# Altium schematic sheet CHIBI SMPS_20181126.SchDoc: Title (part 1 of 2)
size A2; PageSetup: Record=PageOptions|CenterHorizontal=True|CenterVertical=True|PrintScale=0.71|XCorrection=1.00|YCorrection=1.00|PrintKind=0|BorderSize=5000000|LeftOffset=0|BottomOffset=0|Orientation=2|PaperLength=4200|PaperWidth=2970|Scale=100|PaperSource=7|PrintQuality=600|MediaType=1|DitherType=10|PrintScaleMode=1|PaperKind=A3|PaperIndex=8; ApprovedBy: Enter Name; CheckedBy: Enter Name; DrawnBy: Enter Name; Organization: Tymphany; Address1: 2/F, BBK Building; Address2: No. 89 Ande Street, Shang Meilin; Address3: Futian District, Shenzhen; Address4: GuangDong, P.R.C. 518049, China; DocumentNumber: 6; Revision: 0.0.0; SheetNumber: 6; SheetTotal: 6; ProductName: Product Name; PartNumber: Part Number; ModifiedBy: Enter Name; LeadEngineer: Enter Name; Stage: Concept; DCR: 238m|?|OWNERINDEX=8310; DCR: 238m|?|OWNERINDEX=8345; ProjectName: Project Name
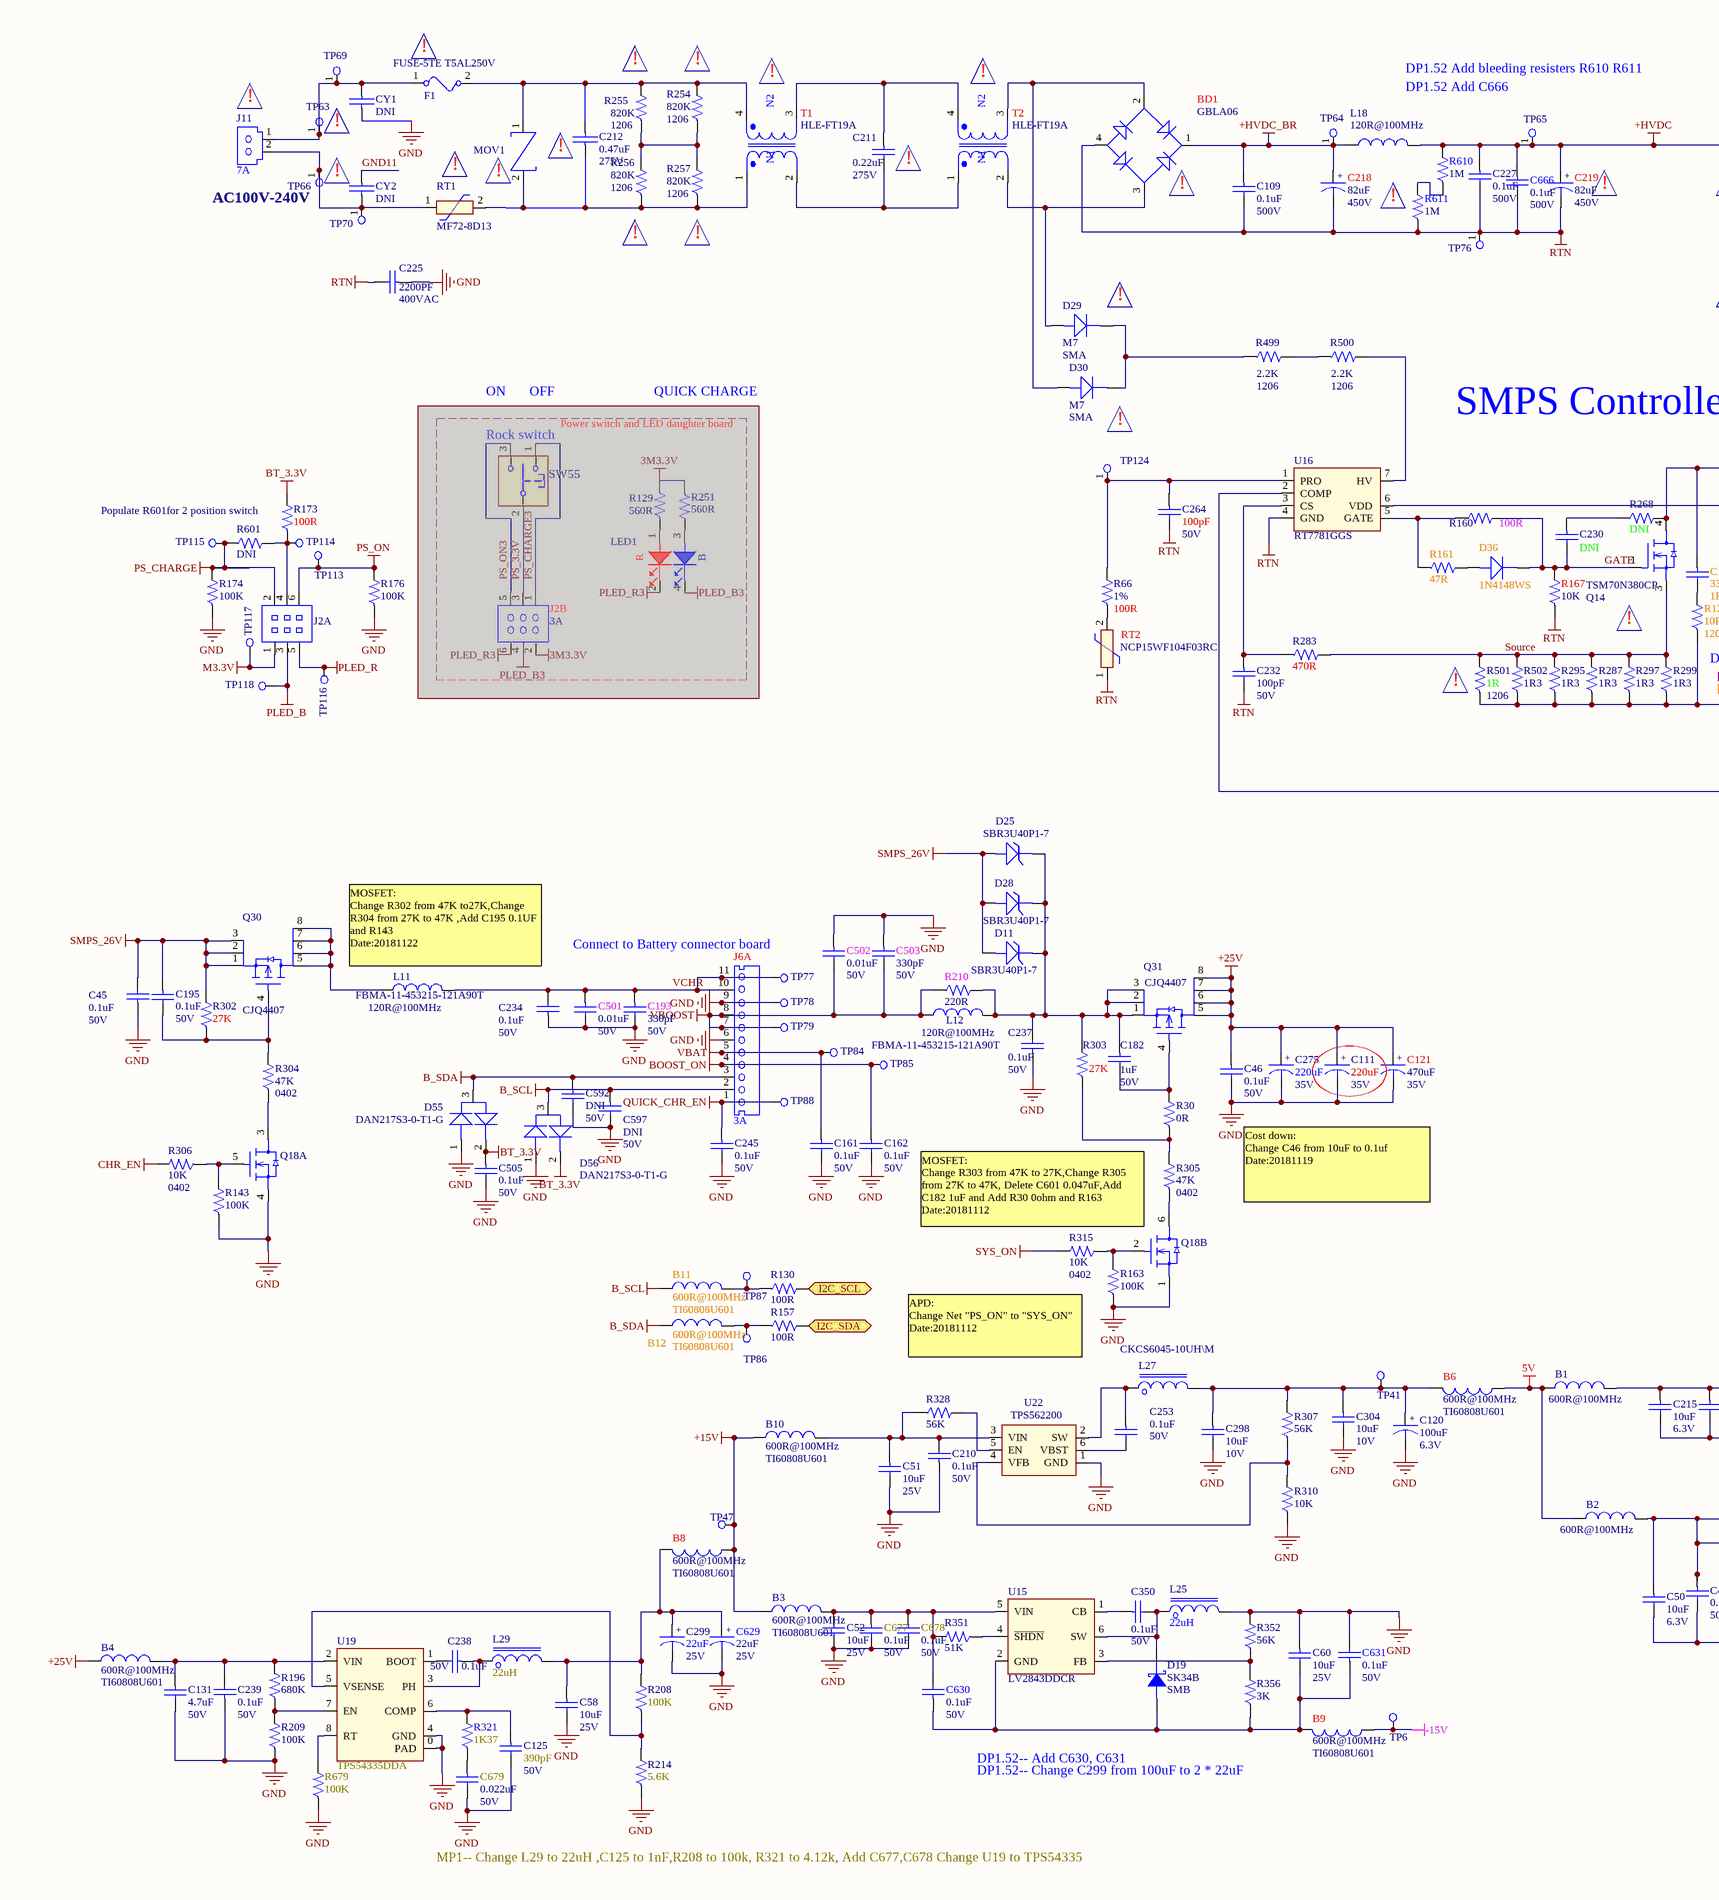
[diagram p0: CHIBI SMPS_20181126.SchDoc, left]
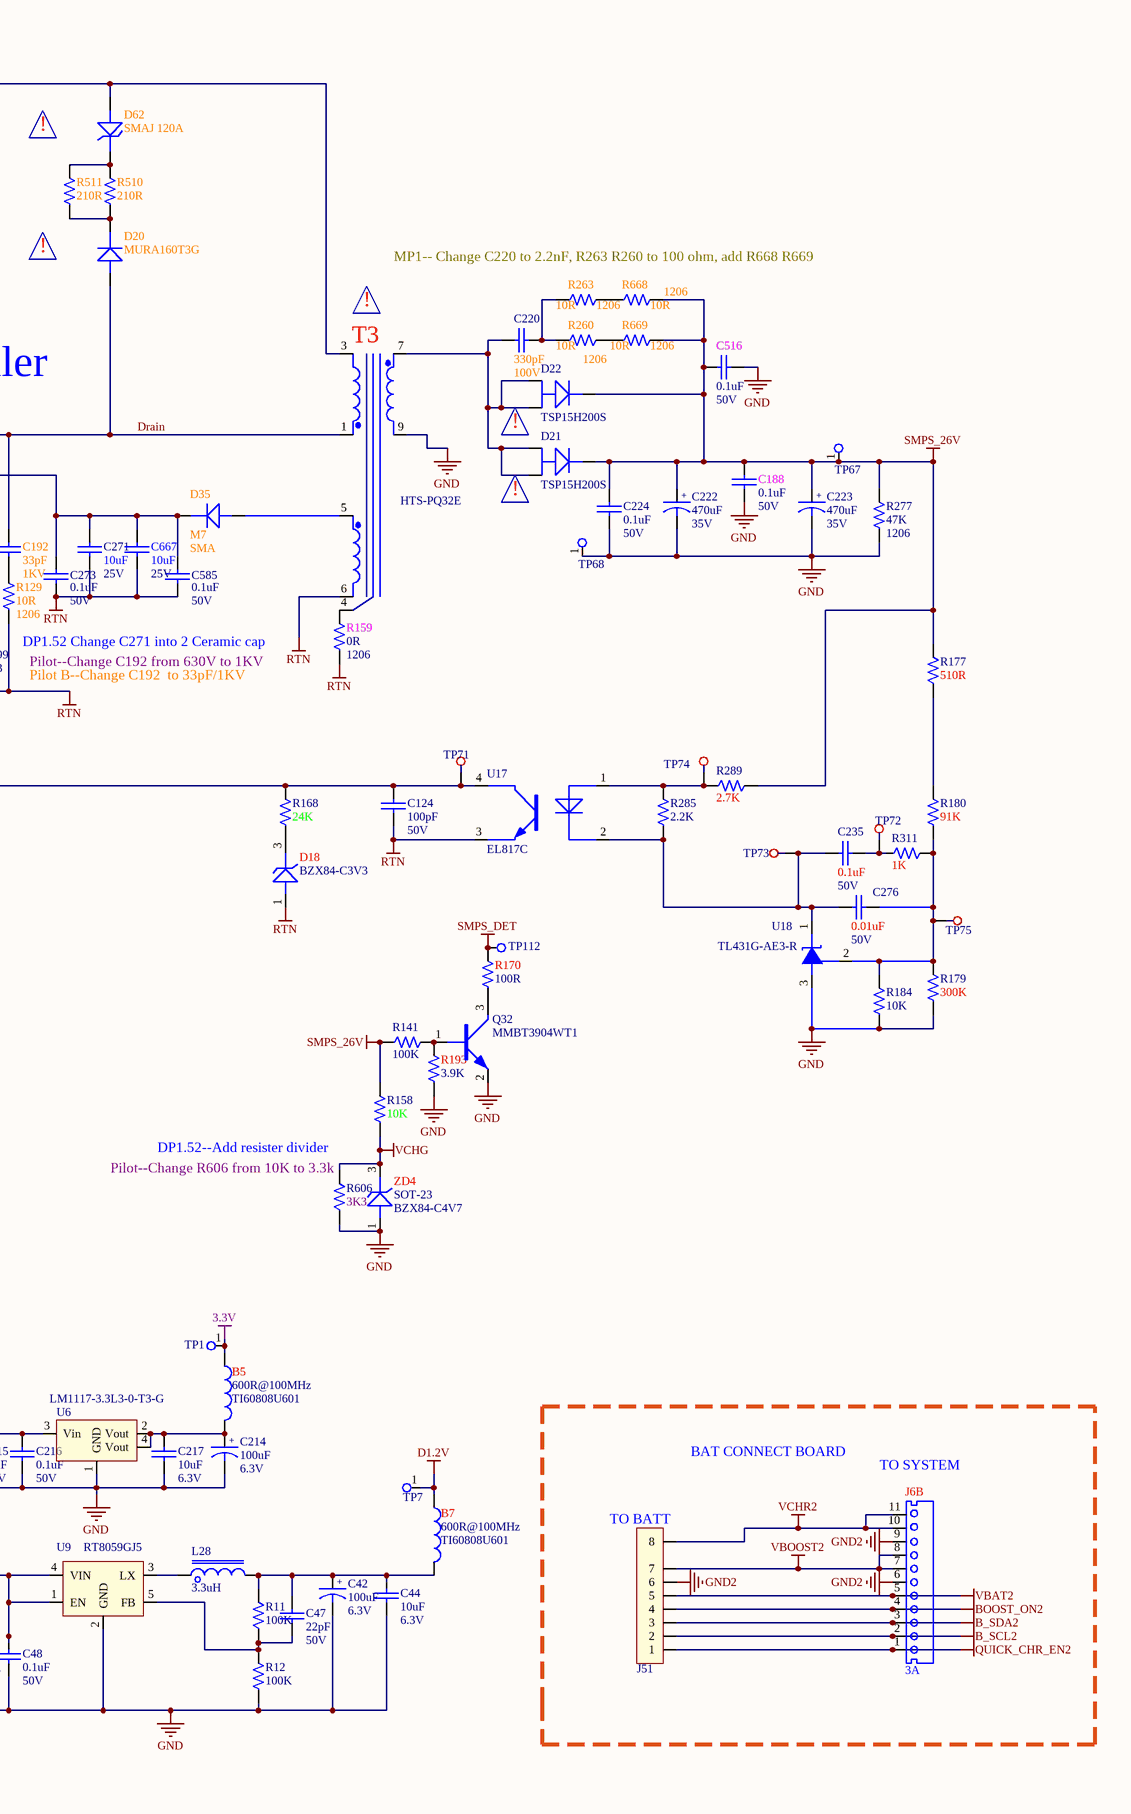
[diagram p1: CHIBI SMPS_20181126.SchDoc, right]

## Parts
(Parts that share a designator on the sheet are numbered #1, #2 ... from top to bottom, then left to right.)
B1  value 600R@100MHz  [L0603-RW]  (hidden comment: SCBA06031-6010)
B2  value 600R@100MHz  [L0603-RW]  (hidden comment: SCBA06031-6010)
B3  value 600R@100MHz  MFG Part: TI60808U601  [L0603-RW]  (hidden comment: SCBA06031-6010)
B4  value 600R@100MHz  MFG Part: TI60808U601  [L0603-RW]  (hidden comment: SCBA06031-6010)
B5  value 600R@100MHz  MFG Part: TI60808U601  [L0603-RW]  (hidden comment: SCBA06031-6010)
B6  value 600R@100MHz  MFG Part: TI60808U601  [L0603-RW]  (hidden comment: SCBA06031-6010)
B7  value 600R@100MHz  MFG Part: TI60808U601  [L0603-RW]  (hidden comment: SCBA06031-6010)
B8  value 600R@100MHz  MFG Part: TI60808U601  [L0603-RW]  (hidden comment: SCBA06031-6010)
B9  value 600R@100MHz  MFG Part: TI60808U601  [L0603-RW]  (hidden comment: SCBA06031-6010)
B10  value 600R@100MHz  MFG Part: TI60808U601  [L0603-RW]  (hidden comment: SCBA06031-6010)
B11  value 600R@100MHz  MFG Part: TI60808U601  [L0603-RW]  (hidden comment: SCBA06031-6010)
B12  value 600R@100MHz  MFG Part: TI60808U601  [L0603-RW]  (hidden comment: SCBA06031-6010)
BD1  T571002850104  [GBL]  (value not drawn)
C42  value 100uF  Voltage: 6.3V  [CASE - C]  (hidden comment: PBE099520-1010)
C44  value 10uF  Voltage: 6.3V  [CAPC0603-RW]  (hidden comment: PXL426521-1060)
C45  value 0.1uF  Voltage: 50V  [CAPC0402-RW]  (hidden comment: PWL456470-1040)
C46  value 0.1uF  Voltage: 50V  [CAPC0402-RW]  (hidden comment: T545011047505)
C47  value 22pF  Voltage: 50V  [CAPC0402-RW]  (hidden comment: PWL410370-2200)
C48  value 0.1uF  Voltage: 50V  [CAPC0402-RW]  (hidden comment: PWL456470-1040)
C50  value 10uF  Voltage: 6.3V  [CAPC0603-RW]  (hidden comment: PXL426521-1060)
C51  value 10uF  Voltage: 25V  [CAPC0805-RW]  (hidden comment: PYL426450-1060)
C52  value 10uF  Voltage: 25V  [CAPC0805-RW]  (hidden comment: PYL426450-1060)
C58  value 10uF  Voltage: 25V  [CAPC0805-RW]  (hidden comment: PYL426450-1060)
C60  value 10uF  Voltage: 25V  [CAPC0805-RW]  (hidden comment: PYL426450-1060)
C109  value 0.1uF  Voltage: 500V  [CAPC3225(1210)-RW]  (hidden comment: T542051047906)
C111  value 220uF  Voltage: 35V  [CASE - F]  (hidden comment: PBE099560-2210)
C120  value 100uF  Voltage: 6.3V  [CASE - C]  (hidden comment: PBE099520-1010)
C121  value 470uF  Voltage: 35V  [CASE - G12.5]  (hidden comment: T551471455000)
C124  value 100pF  Voltage: 50V  [CAPC0603-RW]  (hidden comment: PXL410370-1010)
C125  value 390pF  Voltage: 50V  [CAPC0603-RW]  (hidden comment: T541023916508)
C131  value 4.7uF  Voltage: 50V  [CAPC0805-RW]  (hidden comment: PYL456470-4750)
C161  value 0.1uF  Voltage: 50V  [CAPC0402-RW]  (hidden comment: PWL456470-1040)
C162  value 0.1uF  Voltage: 50V  [CAPC0402-RW]  (hidden comment: PWL456470-1040)
C182  value 1uF  Voltage: 50V  [CAPC0603-RW]  (hidden comment: T542021057508)
C188  value 0.1uF  Voltage: 50V  [CAPC0603-RW]  (hidden comment: PXL456470-1040)
C192  value 33pF  Voltage: 1KV  [CAPC1206-RW]  (hidden comment: T541043306H08)
C193  value 330pF  Voltage: 50V  [CAPC0402-RW]  (hidden comment: PWL410371-3310)
C195  value 0.1uF  Voltage: 50V  [CAPC0603-RW]  (hidden comment: PXL456470-1040)
C210  value 0.1uF  Voltage: 50V  [CAPC0603-RW]  (hidden comment: PXL456470-1040)
C211  value 0.22uF  Voltage: 275V  [CAP_T6W18H12 PH15]  (hidden comment: CAP 0.22uF 275V 10% -T6W18H12 PH15)
C212  value 0.47uF  Voltage: 275V  [CAP_NP_RADIAL_T8.4W18H14P15]  (hidden comment: PVX2394G0-4740)
C214  value 100uF  Voltage: 6.3V  [CASE - C]  (hidden comment: PBE099520-1010)
C215  value 10uF  Voltage: 6.3V  [CAPC0603-RW]  (hidden comment: PXL426521-1060)
C216  value 0.1uF  Voltage: 50V  [CAPC0402-RW]  (hidden comment: PWL456470-1040)
C217  value 10uF  Voltage: 6.3V  [CAPC0603-RW]  (hidden comment: PXL426521-1060)
C218  value 82uF  Voltage: 450V  [CAP_Radial_D18L25P7.5]  (hidden comment: T5528204D3010)
C219  value 82uF  Voltage: 450V  [CAP_Radial_D18L25P7.5]  (hidden comment: T5528204D3010)
C220  value 330pF  Voltage: 100V  [CAPC0603-RW]  (hidden comment: PXL4564A0-3310)
C222  value 470uF  Voltage: 35V  [CASE - G12.5]  (hidden comment: T551471455000)
C223  value 470uF  Voltage: 35V  [CASE - G12.5]  (hidden comment: T551471455000)
C224  value 0.1uF  Voltage: 50V  [CAPC0603-RW]  (hidden comment: PXL456470-1040)
C225  value 2200PF  Voltage: 400VAC  [Y1 102M40AXC3  Y1 222M40AXC3]  (hidden comment: T564222414030)
C227  value 0.1uF  Voltage: 500V  [CAPC3225(1210)-RW]  (hidden comment: T542051047906)
C230  SAP: DNI  [CAPC1206-RW]  (hidden comment: PZL4103M1-1010)
C232  value 100pF  Voltage: 50V  [CAPC0603-RW]  (hidden comment: PXL410370-1010)
C234  value 0.1uF  Voltage: 50V  [CAPC0402-RW]  (hidden comment: PWL456470-1040)
C235  value 0.1uF  Voltage: 50V  [CAPC0603-RW]  (hidden comment: PXL456470-1040)
C237  value 0.1uF  Voltage: 50V  [CAPC0402-RW]  (hidden comment: PWL456470-1040)
C238  value 0.1uF  Voltage: 50V  [CAPC0603-RW]  (hidden comment: PXL456470-1040)
C239  value 0.1uF  Voltage: 50V  [CAPC0603-RW]  (hidden comment: PXL456470-1040)
C245  value 0.1uF  Voltage: 50V  [CAPC0402-RW]  (hidden comment: PWL456470-1040)
C253  value 0.1uF  Voltage: 50V  [CAPC0603-RW]  (hidden comment: PXL456470-1040)
C264  value 100pF  Voltage: 50V  [CAPC0603-RW]  (hidden comment: PXL410370-1010)
C271  value 10uF  Voltage: 25V  [CAPC1206-RW]  (hidden comment: PZL456450-1060)
C273  value 0.1uF  Voltage: 50V  [CAPC0402-RW]  (hidden comment: PWL456470-1040)
C275  value 220uF  Voltage: 35V  [CASE - F]  (hidden comment: PBE099560-2210)
C276  value 0.01uF  Voltage: 50V  [CAPC0603-RW]  (hidden comment: T542021036508)
C298  value 10uF  Voltage: 10V  [CAPC0603-RW]  (hidden comment: T54000000260E)
C299  value 22uF  Voltage: 25V  [CASE - C]  (hidden comment: PBE099550-2200)
C304  value 10uF  Voltage: 10V  [CAPC0603-RW]  (hidden comment: T54000000260E)
C350  value 0.1uF  Voltage: 50V  [CAPC0603-RW]  (hidden comment: PXL456470-1040)
C501  value 0.01uF  Voltage: 50V  [CAPC0402-RW]  (hidden comment: PWL456470-1030)
C502  value 0.01uF  Voltage: 50V  [CAPC0402-RW]  (hidden comment: PWL456470-1030)
C503  value 330pF  Voltage: 50V  [CAPC0402-RW]  (hidden comment: PWL410371-3310)
C505  value 0.1uF  Voltage: 50V  [CAPC0402-RW]  (hidden comment: PWL456470-1040)
C516  value 0.1uF  Voltage: 50V  [CAPC0603-RW]  (hidden comment: PXL456470-1040)
C585  value 0.1uF  Voltage: 50V  [CAPC0402-RW]  (hidden comment: PWL456470-1040)
C592  value DNI  Voltage: 50V  [CAPC0402-RW]  (hidden comment: T54000000484E)
C597  value DNI  Voltage: 50V  [CAPC0402-RW]  (hidden comment: T54000000484E)
C629  value 22uF  Voltage: 25V  [CASE - C]  (hidden comment: PBE099550-2200)
C630  value 0.1uF  Voltage: 50V  [CAPC0603-RW]  (hidden comment: PXL456470-1040)
C631  value 0.1uF  Voltage: 50V  [CAPC0603-RW]  (hidden comment: PXL456470-1040)
C666  value 0.1uF  Voltage: 500V  [CAPC3225(1210)-RW]  (hidden comment: T542051047906)
C667  value 10uF  Voltage: 25V  [CAPC1206-RW]  (hidden comment: PZL456450-1060)
C677  value 0.1uF  Voltage: 50V  [CAPC0402-RW]  (hidden comment: PWL456470-1040)
C678  value 0.1uF  Voltage: 50V  [CAPC0402-RW]  (hidden comment: PWL456470-1040)
C679  value 0.022uF  Voltage: 50V  [CAPC0603-RW]  (hidden comment: PXL456470-2230)
CY1  value DNI  [CAP_NP_RADIAL_T6.5L17H12P10]  (hidden comment: PLY1365K0-1040)
CY2  value DNI  [CAP_NP_RADIAL_T6.5L17H12P10]  (hidden comment: PLY1365K0-1040)
D11  T571002830230  [PowerDI-123]  (value not drawn)
D18  T573000910415  [SOT23-132-RW]  (value not drawn)
D19  MFG Part: SK34B  Package: SMB  [SMB-Pad2.3X2.5]  (hidden comment: T572006222208)
D20  T571002720225  [SMA]  (value not drawn)
D21  T572005721008  [TO-277A (SMPC)]  (value not drawn)
D22  T572005721008  [TO-277A (SMPC)]  (value not drawn)
D25  T571002830230  [PowerDI-123]  (value not drawn)
D28  T571002830230  [PowerDI-123]  (value not drawn)
D29  MFG Part: M7  [SMA]  (hidden comment: T571002880658)
D30  MFG Part: M7  [SMA]  (hidden comment: T571002880658)
D35  MFG Part: M7  [SMA]  (hidden comment: T571002880658)
D36  RCD114148-0020  [SOD-323]  (value not drawn)
D55  T572006171251  [SOT323(SC-70)-R]  (value not drawn)
D56  T572006171251  [SOT323(SC-70)-R]  (value not drawn)
D62  T572006272108  [SMA]  (value not drawn)
F1  MFG Part: FUSE-5TE T5AL250V  [FUSE-TE5-8540]  (hidden comment: T690100003600)
J2A  T690300110100  [HOUSING  6P 2X3 PH=2.54mm 180  H8.5mm_2.54Y-2X3P-11.5]  (value not drawn)
J2B  Current: 3A  [HEAD 6P 2X3 PH=2.54mm 180 H8.5mm]  (hidden comment: T690300101200)  (masked out: inside a compile mask, not in the netlist)
J6A  Current: 3A  [CONN 11P PH=2.5 ST TJC3-11A-CS]  (hidden comment: T690300109800)
J6B  Current: 3A  [CONN 11P PH=2.5 ST TJC3-11A-CS]  (hidden comment: T690300109800)
J11  Current: 7A  [CONN 2P PH=3.96mm RM Mid-PIN_JINJIA_VH-3A2-01]  (hidden comment: T690300109500)
J51  T690300109900  [HEAD 8P PH=2.5mm SR ST TSB1-05281-3BT8A]  (value not drawn)
L11  value 120R@100MHz  MFG Part: FBMA-11-453215-121A90T  [L1812(4532)]  (hidden comment: T710500015400)
L12  value 120R@100MHz  MFG Part: FBMA-11-453215-121A90T  [L1812(4532)]  (hidden comment: T710500015400)
L18  value 120R@100MHz  [L1812(4532)]  (hidden comment: T710500015400)
L25  value 22uH  [GPSR0550-220M]  (hidden comment: T621000054100)
L27  MFG Part: CKCS6045-10UH\M  [IND MPIT6045]  (hidden comment: T621000050100)
L28  value 3.3uH  [IND MPIT252012]  (hidden comment: T621000050300)
L29  value 22uH  [GPSR0550-220M]  (hidden comment: T621000054100)
LED1  KCD260004-0010  [SMTLED2.0*1.25-RGB]  (value not drawn)  (masked out: inside a compile mask, not in the netlist)
MOV1  RHU014561-4001  [TVR14561RSY]  (value not drawn)
Q14  T586000010398  [TO252-3]  (value not drawn)
Q18  RCM027002-1001  [SOT-363]  (value not drawn)  (parts A,B of 2)
Q30  T585002521866  [SO8]  (value not drawn)
Q31  T585002521866  [SO8]  (value not drawn)
Q32  T581003992440  [SOT323(SC-70)-R]  (value not drawn)
R11  value 100K  [0402-RW]  (hidden comment: QCF161240-1003)
R12  value 100K  [0402-RW]  (hidden comment: QCF161240-1003)
R30  value 0R  [0402-RW]  (hidden comment: QCF165240-0000)
R66  value 100R  TOL: 1%  [0603-RW]  (hidden comment: T502100002399)
R129#1  value 560R  [0603-RW]  (hidden comment: QCF011030-5600)  (masked out: inside a compile mask, not in the netlist)
R129#2  value 10R  PACKAGE: 1206  [1206-RW]  (hidden comment: QCF045010-1000)
R130  value 100R  [0402-RW]  (hidden comment: QCF161240-1000)
R141  value 100K  [0402-RW]  (hidden comment: QCF161240-1003)
R143  value 100K  [0402-RW]  (hidden comment: QCF161240-1003)
R157  value 100R  [0402-RW]  (hidden comment: QCF161240-1000)
R158  value 10K  [0402-RW]  (hidden comment: QCF161240-1002)
R159  value 0R  PACKAGE: 1206  [1206-RW]  (hidden comment: QCF045010-0000)
R160  value 100R  [0603-RW]  (hidden comment: QCF011030-1000)
R161  value 47R  [0805-RW]  (hidden comment: QCF081020-4709)
R163  value 100K  [0402-RW]  (hidden comment: QCF161240-1003)
R167  value 10K  [0805-RW]  (hidden comment: QCF081020-1002)
R168  value 24K  [0603-RW]  (hidden comment: QCF011030-2402)
R170  value 100R  [0402-RW]  (hidden comment: QCF161240-1000)
R173  value 100R  [0402-RW]  (hidden comment: QCF161240-1000)
R174  value 100K  [0402-RW]  (hidden comment: QCF161240-1003)
R176  value 100K  [0402-RW]  (hidden comment: QCF161240-1003)
R177  value 510R  [0603-RW]  (hidden comment: QCF011030-5100)
R179  value 300K  [0603-RW]  (hidden comment: QCF011030-3003)
R180  value 91K  [0603-RW]  (hidden comment: QCF011030-9102)
R184  value 10K  [0603-RW]  (hidden comment: QCF011030-1002)
R193  value 3.9K  [0402-RW]  (hidden comment: QCF161241-3901)
R196  value 680K  [0402-RW]  (hidden comment: QCF161240-6803)
R208  value 100K  [0402-RW]  (hidden comment: QCF161240-1003)
R209  value 100K  [0402-RW]  (hidden comment: QCF161240-1003)
R210  value 220R  [0603-RW]  (hidden comment: QCF011030-2200)
R214  value 5.6K  [0402-RW]  (hidden comment: T502560101399)
R251  value 560R  [0603-RW]  (hidden comment: QCF011030-5600)  (masked out: inside a compile mask, not in the netlist)
R254  value 820K  PACKAGE: 1206  [1206-RW]  (hidden comment: QCF041010-8203)
R255  value 820K  PACKAGE: 1206  [1206-RW]  (hidden comment: QCF041010-8203)
R256  value 820K  PACKAGE: 1206  [1206-RW]  (hidden comment: QCF041010-8203)
R257  value 820K  PACKAGE: 1206  [1206-RW]  (hidden comment: QCF041010-8203)
R260  value 10R  PACKAGE: 1206  [1206-RW]  (hidden comment: QCF045010-1000)
R263  value 10R  PACKAGE: 1206  [1206-RW]  (hidden comment: QCF045010-1000)
R268  SAP: DNI  [1206-RW]  (hidden comment: QCF041010-4708)
R277  value 47K  PACKAGE: 1206  [1206-RW]  (hidden comment: QCF041010-4702)
R283  value 470R  [0603-RW]  (hidden comment: QCF011030-4700)
R285  value 2.2K  [0603-RW]  (hidden comment: QCF011030-2201)
R287  value 1R3  [1206-RW]  (hidden comment: T710600016700)
R289  value 2.7K  [0603-RW]  (hidden comment: QCF011030-2701)
R295  value 1R3  [1206-RW]  (hidden comment: T710600016700)
R297  value 1R3  [1206-RW]  (hidden comment: T710600016700)
R299  value 1R3  [1206-RW]  (hidden comment: T710600016700)
R302  value 27K  [0402-RW]  (hidden comment: QCF161242-2702)
R303  value 27K  [0402-RW]  (hidden comment: QCF161242-2702)
R304  value 47K  PACKAGE: 0402  [0402-RW]  (hidden comment: QCF161243-4702)
R305  value 47K  PACKAGE: 0402  [0402-RW]  (hidden comment: QCF161243-4702)
R306  value 10K  PACKAGE: 0402  [0402-RW]  (hidden comment: QCF161240-1002)
R307  value 56K  [0402-RW]  (hidden comment: QCF161240-5602)
R310  value 10K  [0402-RW]  (hidden comment: QCF161240-1002)
R311  value 1K  [0603-RW]  (hidden comment: QCF011030-1001)
R315  value 10K  PACKAGE: 0402  [0402-RW]  (hidden comment: QCF161240-1002)
R321  value 1K37  [0603-RW]  (hidden comment: T502137102399)
R328  value 56K  [0402-RW]  (hidden comment: QCF161240-5602)
R351  value 51K  [0603-RW]  (hidden comment: QCF011030-5102)
R352  value 56K  [0402-RW]  (hidden comment: QCF161240-5602)
R356  value 3K  [0603-RW]  (hidden comment: QCF011030-3001)
R499  value 2.2K  PACKAGE: 1206  [1206-RW]  (hidden comment: QCF041010-2201)
R500  value 2.2K  PACKAGE: 1206  [1206-RW]  (hidden comment: QCF041010-2201)
R501  value 1R  PACKAGE: 1206  [1206-RW]  (hidden comment: T710600016600)
R502  value 1R3  [1206-RW]  (hidden comment: T710600016700)
R510  value 210R  [1206-RW]  (hidden comment: T502210004399)
R511  value 210R  [1206-RW]  (hidden comment: T502210004399)
R601  value DNI  [0603-RW]  (hidden comment: QCF011030-1002)
R606  value 3K3  [0402-RW]  (hidden comment: QCF161241-3301)
R610  value 1M  [0805-RW]  (hidden comment: QCF081020-1004)
R611  value 1M  [0805-RW]  (hidden comment: QCF081020-1004)
R668  value 10R  PACKAGE: 1206  [1206-RW]  (hidden comment: QCF045010-1000)
R669  value 10R  PACKAGE: 1206  [1206-RW]  (hidden comment: QCF045010-1000)
R679  value 100K  [0402-RW]  (hidden comment: QCF161240-1003)
RT1  RNT004001-0001  [MF72-8D13]  (value not drawn)
RT2  MFG Part: NCP15WF104F03RC  [0402-RW]  (hidden comment: T710600016200)
SW55  T670000000300  [ROCKER SW RS601K-103]  (value not drawn)  (masked out: inside a compile mask, not in the netlist)
T1  MFG Part: HLE-FT19A  [COMMON IND HLE-FT19A]  (hidden comment: T621000052200)
T2  MFG Part: HLE-FT19A  [COMMON IND HLE-FT19A]  (hidden comment: T621000052200)
T3  T622000009700  [HTS-PQ32E]  (value not drawn)
TP1  D3.3V  [TP_1.5mm]  (value not drawn)
TP6  TP  [TP_1.2mm]  (value not drawn)
TP7  D1.2V  [TP_1.2mm]  (value not drawn)
TP41  TP  [TP_1.2mm]  (value not drawn)
TP47  TP  [TP_1.2mm]  (value not drawn)
TP63  TP  [TP_2.0mm]  (value not drawn)
TP64  TP  [TP_2.0mm]  (value not drawn)
TP65  TP  [TP_2.0mm]  (value not drawn)
TP66  TP  [TP_2.0mm]  (value not drawn)
TP67  TP  [TP_1.8mm]  (value not drawn)
TP68  TP  [TP_1.8mm]  (value not drawn)
TP69  TP  [TP_2.0mm]  (value not drawn)
TP70  TP  [TP_2.0mm]  (value not drawn)
TP71  1.0mm  [TP_1.0mm]  (value not drawn)
TP72  1.0mm  [TP_1.0mm]  (value not drawn)
TP73  1.0mm  [TP_1.0mm]  (value not drawn)
TP74  1.0mm  [TP_1.0mm]  (value not drawn)
TP75  1.0mm  [TP_1.0mm]  (value not drawn)
TP76  TP  [TP_2.0mm]  (value not drawn)
TP77  TP  [TP_1.2mm]  (value not drawn)
TP78  TP  [TP_1.2mm]  (value not drawn)
TP79  TP  [TP_1.2mm]  (value not drawn)
TP84  TP  [TP_1.2mm]  (value not drawn)
TP85  TP  [TP_1.2mm]  (value not drawn)
TP86  TP  [TP_1.2mm]  (value not drawn)
TP87  TP  [TP_1.2mm]  (value not drawn)
TP88  TP  [TP_1.2mm]  (value not drawn)
TP112  TP  [TP_1.2mm]  (value not drawn)
TP113  TP  [TP_1.2mm]  (value not drawn)
TP114  TP  [TP_1.2mm]  (value not drawn)
TP115  TP  [TP_1.2mm]  (value not drawn)
TP116  TP  [TP_1.2mm]  (value not drawn)
TP117  TP  [TP_1.2mm]  (value not drawn)
TP118  TP  [TP_1.2mm]  (value not drawn)
TP124  TP  [TP_1.8mm]  (value not drawn)
U6  T610600101194  [SOT223]  (value not drawn)
U9  MFG PART: RT8059GJ5  [SOT23-5 P.95]  (hidden comment: RCI008059-1001)
U15  MFG Part: LV2843DDCR  [DBV(R-PDSO-G6)]  (hidden comment: RCI002843-0001)
U16  MFG Part: RT7781GGS  [SO7]  (hidden comment: T610000055710)
U17  MFG Part: EL817C  [EL817-S1]  (hidden comment: RCI000817-0001)
U18  MFG Part: TL431G-AE3-R  [TL431G-AE3-R_UTC]  (hidden comment: T610600100708)
U19  MFG Part: TPS54335DDA  [DDA(R-PDSO-G8)]  (hidden comment: RCI054335-0001)
U22  RCI562200-0001  [SOT23-6 P.95]  (value not drawn)
ZD4  Package: SOT-23  [SOT23-132-RW]  (hidden comment: T573004040415)

## Blocks framed on the sheet
Rock switch: J2B LED1 R129#1 R251 SW55

## Ports
I2C_SCL (bidir), I2C_SDA (bidir)

## Nets
3.3V: B5.1 TP1.1
5V: B1.1 B2.1 B6.1
+15V: B3.1 B8.1 B10.1 TP47.1
+25V: B4.1 C46.1 C111.1 C121.1 C275.1 Q31.5(D) Q31.6(D) Q31.7(D) Q31.8(D)
+HVDC: C219.1 C227.1 C666.1 D62.1(A) L18.2 R610.2 T3.3 TP65.1
+HVDC_BR: BD1.1(K) C109.1 C218.1 L18.1 TP64.1
-15V: B9.1 TP6.1
B_SCL: B11.1 C597.1 D56.3(C) J6A.2
B_SCL2: J6B.2 J51.2
B_SDA: B12.1 C592.1 D55.3(C) J6A.3
B_SDA2: J6B.3 J51.3
BOOST_ON: C162.1 J6A.4 TP85.1
BOOST_ON2: J6B.4 J51.4
BT_3.3V: C505.1 D55.2(K) D56.2(K) R173.2
CHR_EN: R306.2
D1.2V: B7.1 TP7.1
GND: C42.2 C44.2 C45.1 C46.2 C48.2 C50.2 C51.2 C52.2 C58.2 C60.1 C111.2 C120.2 C121.2 C125.2 C131.2 C161.2 C162.2 C188.1 C193.2 C210.1 C214.2 C215.2 C216.2 C217.2 C222.2 C223.2 C224.2 C225.1 C234.1 C237.1 C239.1 C245.2 C275.2 C298.2 C299.2 C304.2 C501.2 C502.1 C503.1 C505.2 C516.1 C592.2 C597.2 C629.2 C631.2 C677.2 C678.2 C679.2 CY1.1 D55.1(A) D56.1(A) J6A.6 J6A.9 L25.2 Q18.1(S) Q18.4(S) Q32.2(E) R12.1 R143.1 R163.1 R174.1 R176.1 R179.1 R184.1 R193.1 R209.1 R214.1 R277.1 R310.1 R352.2 R606.1 R679.1 T3.9(Sec1+) TP68.1 TP78.1 U6.1(GND) U9.2(GND) U18.3(A) U19.0(PAD) U19.4(GND) U22.1(GND) ZD4.1(A)
GND2: J6B.6 J6B.9 J51.6
M3.3V: J2A.1 TP117.1
PLED_B: J2A.3 TP118.1
PLED_R: J2A.5 TP116.1
PS_CHARGE: J2A.2 R174.2 R601.1 TP115.1
PS_ON: J2A.6 R176.2 TP113.1
QUICK_CHR_EN: C245.1 J6A.1 TP88.1
QUICK_CHR_EN2: J6B.1 J51.1
RTN: BD1.4(K) C109.2 C124.2 C218.2 C219.2 C225.2 C227.2 C232.2 C264.2 C271.2 C273.2 C585.2 C666.2 C667.2 D18.1(A) R129#2.1 R159.1 R167.1 R287.1 R295.1 R297.1 R299.1 R501.1 R502.1 R611.1 RT2.1 T3.6 TP76.1 U16.4(GND) U17.3(C)
SMPS_26V: C45.2 C188.2 C195.1 C222.1 C223.1 C224.1 C516.2 D11.1(A) D21.3(K) D22.3(K) D25.1(A) D28.1(A) Q30.1(S) Q30.2(S) Q30.3(S) R141.1 R158.2 R177.2 R277.2 R289.2 R302.2 R668.2 R669.2 TP67.1
SMPS_DET: R170.2 TP112.1
SYS_ON: R315.2
VBAT: C161.1 J6A.5 TP84.1
VBAT2: J6B.5 J51.5
VBOOST: C502.2 C503.2 J6A.7 J6A.8 L12.1 R210.1 TP79.1
VBOOST2: J6B.7 J6B.8 J51.7
VCHG: R158.1 R606.2 ZD4.3(A)
VCHR2: J6B.10 J6B.11 J51.8
Drain: C192.1 D20.1(A) Q14.4(D) R268.2 T3.1(Pri+)
GATE: C230.2 D36.2(K) Q14.1(G) R160.2 R167.2
GND11: CY2.2
I2C_SCL: R130.2 ; port I2C_SCL
I2C_SDA: R157.2 ; port I2C_SDA
Source: Q14.3(S) R283.2 R287.2 R295.2 R297.2 R299.2 R501.2 R502.2
VCHR: C193.1 C234.2 C501.1 J6A.10 J6A.11 L11.2 TP77.1
NetB1_2: B1.2 C215.1 C216.1 U6.3(Vin)
NetB2_2: B2.2 C48.1 C50.1 U9.1(EN) U9.4(VIN)
NetB3_2: B3.2 C52.1 C630.2 C677.1 C678.1 R351.2 U15.5(VIN)
NetB4_2: B4.2 C131.1 C239.2 R196.2 U19.2(VIN)
NetB5_2: B5.2 C214.1 C217.1 U6.2(Vout) U6.4(Vout)
NetB6_2: B6.2 C120.1 C298.1 C304.1 L27.2 R307.2 TP41.1
NetB7_2: B7.2 C42.1 C44.1 C47.1 L28.2 R11.2
NetB8_2: B8.2 C58.1 C299.1 C629.1 L29.2 R208.2
NetB9_2: B9.2 C60.2 C630.1 C631.1 D19.1(A) R356.1 U15.2(GND)
NetB10_2: B10.2 C51.1 C210.2 R328.1 U22.3(VIN)
NetB11_2: B11.2 R130.1 TP87.1
NetB12_2: B12.2 R157.1 TP86.1
NetBD1_2: BD1.2(A) D30.1(A) T2.3
NetBD1_3: BD1.3(K) D29.1(A) T2.2
NetC47_2: C47.2 R11.1 R12.2 U9.5(FB)
NetC124_1: C124.1 R168.2 TP71.1 U16.2(COMP) U17.4(C)
NetC125_1: C125.1 R321.2 U19.6(COMP)
NetC182_1: C182.1 C237.2 D11.2(K) D25.2(K) D28.2(K) L12.2 Q31.1(S) Q31.2(S) Q31.3(S) R210.2 R303.2
NetC182_2: C182.2 Q31.4(G) R30.2
NetC192_2: C192.2 R129#2.2
NetC195_2: C195.2 Q30.4(G) R302.1 R304.2
NetC211_1: C211.1 T1.3 T2.4
NetC211_2: C211.2 T1.2 T2.1
NetC212_1: C212.1 F1.2 MOV1.1 R254.2 R255.2 T1.4
NetC212_2: C212.2 MOV1.2 R256.1 R257.1 RT1.2 T1.1
NetC220_1: C220.1 D21.1(A1) D21.2(A2) D22.1(A1) D22.2(A2) T3.7
NetC220_2: C220.2 R260.1 R263.1
NetC230_1: C230.1 R268.1
NetC232_1: C232.1 R283.1 U16.3(CS)
NetC235_1: C235.1 C276.1 R285.1 TP73.1 U17.2(E) U18.1(K)
NetC235_2: C235.2 R311.1 TP72.1
NetC238_1: C238.1 L29.1 U19.3(PH)
NetC238_2: C238.2 U19.1(BOOT)
NetC253_1: C253.1 L27.1 U22.2(SW)
NetC253_2: C253.2 U22.6(VBST)
NetC264_1: C264.1 R66.2 TP124.1 U16.1(PRO)
NetC271_1: C271.1 C273.1 C585.1 C667.1 D35.2(K) U16.6(VDD)
NetC276_2: C276.2 R179.2 R180.1 R184.2 R311.2 TP75.1 U18.2(R)
NetC350_1: C350.1 U15.1(CB)
NetC350_2: C350.2 D19.2(K) L25.1 U15.6(SW)
NetC679_1: C679.1 R321.1
NetCY1_2: CY1.2 F1.1 J11.1 TP63.1 TP69.1
NetCY2_1: CY2.1 J11.2 RT1.1 TP66.1 TP70.1
NetD18_3: D18.3(K) R168.1
NetD20_2: D20.2(K) R510.1 R511.1
NetD29_2: D29.2(K) D30.2(K) R499.1
NetD35_1: D35.1(A) T3.5
NetD36_1: D36.1(A) R161.2
NetD62_2: D62.2(K) R510.2 R511.2
NetJ2A_4: J2A.4 R173.1 R601.2 TP114.1
NetL11_1: L11.1 Q30.5(D) Q30.6(D) Q30.7(D) Q30.8(D)
NetL28_1: L28.1 U9.3(LX)
NetQ18_2: Q18.2(G) R163.2 R315.1
NetQ18_3: Q18.3(D) R304.1
NetQ18_5: Q18.5(G) R143.2 R306.1
NetQ18_6: Q18.6(D) R305.1
NetQ32_1: Q32.1(B) R141.2 R193.2
NetQ32_3: Q32.3(C) R170.1
NetR30_1: R30.1 R303.1 R305.2
NetR66_1: R66.1 RT2.2
NetR159_2: R159.2 T3.4(Pri-)
NetR160_1: R160.1 R161.1 U16.5(GATE)
NetR177_1: R177.1 R180.2
NetR196_1: R196.1 R209.2 U19.7(EN)
NetR208_1: R208.1 R214.2 U19.5(VSENSE)
NetR254_1: R254.1 R255.1 R256.2 R257.2
NetR260_2: R260.2 R669.1
NetR263_2: R263.2 R668.1
NetR285_2: R285.2 R289.1 TP74.1 U17.1(B)
NetR307_1: R307.1 R310.2 U22.4(VFB)
NetR328_2: R328.2 U22.5(EN)
NetR351_1: R351.1 U15.4(~{SHDN})
NetR352_1: R352.1 R356.2 U15.3(FB)
NetR499_2: R499.2 R500.1
NetR500_2: R500.2 U16.7(HV)
NetR610_1: R610.1 R611.2
NetR679_2: R679.2 U19.8(RT)

## Notes on the sheet
- (near F1) !
- (near R255) !
- (near R254) !
- (near T1) !
- (near T2) !
- DP1.52 Add bleeding resisters R610 R611
- DP1.52 Add C666
- (near J11) !
- !
- (near C212) !
- (near TP66) AC100V-240V
- (near RT1) !
- (near MOV1) !
- (near C211) !
- (near BD1) !
- (near R611) !
- (near C219) !
- (near R256) !
- (near R257) !
- (near D29) !
- (near R511) !
- MP1-- Change C220 to 2.2nF, R263 R260 to 100 ohm, add R668 R669
- ON
- OFF
- QUICK CHARGE
- (near T3) !
- (near SW55) Power switch and LED daughter board
- (near D30) !
- SMPS Controller
- (near R173) Populate R601for 2 position switch
- (near D21) !
- (near R501) !
- (near R129#2) DP1.52 Change C271 into 2 Ceramic cap
- Pilot--Change C192 from 630V to 1KV
- Pilot B--Change C192  to 33pF/1KV
- MOSFET:
  Change R302 from 47K to27K,Change R304 from 27K to 47K ,Add C195 0.1UF and R143
  Date:20181122
- Connect to Battery connector board
- (near R606) Pilot--Change R606 from 10K to 3.3k
- DP1.52--Add resister divider
- Cost down:
  Change C46 from 10uF to 0.1uf
  Date:20181119
- (near Q18) MOSFET:
  Change R303 from 47K to 27K,Change R305 from 27K to 47K, Delete C601 0.047uF,Add C182 1uF and Add R30 0ohm and R163
  Date:20181112
- APD:
  Change Net "PS_ON" to "SYS_ON"
  Date:20181112
- BAT CONNECT BOARD
- (near J6B) TO SYSTEM
- (near J51) TO BATT
- DP1.52-- Add C630, C631
- DP1.52-- Change C299 from 100uF to 2 * 22uF
- MP1-- Change L29 to 22uH ,C125 to 1nF,R208 to 100k, R321 to 4.12k, Add C677,C678 Change U19 to TPS54335
- Version
- Date
- Description of Changes/Notes
- Client
- (Hui Zhou) Co. Ltd., Shenzhen Branch
- Premium Loudspeakers
- Product:
- File Name:
- Page Title:
- CHIBI
- CHIBI Main Board
- Requirement of Tymphany Parts:
  1. Comply with Tymphany QSI057-1031 "Green Product Chemical Substances Specification".
  2. Follow customer's specification as required.
  3. Follow Halogen Free requirement: Br<900 ppm, Cl<900 ppm, Br+Cl< 1500 ppm if required.
- www.Tymphany.com
- Tel: + 86 755-339-121-88
- GuangDong, P.R.C. 518049, China
- Futian District, Shenzhen
- No. 89 Ande Street, Shang Meilin
- 2/F, BBK Building
- Revision:
- Stage:
- Lead Engineer:
- Date:
- Part Number:
- SOP(Ver B)
- 3.1.1
- Sam
- T651000009390
- Drawn By:
- Checked By:
- Time:
- Gavin
- Mod By:
- Approved By:
- Sheet:
- Mod Date:
- Size:
- A2
- of
- Seb
- (in symbol CAP E 100uF 6.3V 20% SMD) +
- (in symbol CAP E 220uF 35V 20% SMD) +
- (in symbol CAP E 470uF 35V 20% SMD_VZH471M1V1013-TR0) +
- (in symbol CAP E  22uF 25V 20%_SMD) +
- (in symbol CAP E Aluminum 82uF 450V 20%) +
- (in symbol COMMON IND HLE-FT19A) N2; N1
- (in symbol MS-PTB2012CURSGAC_RED/BLUE) R; B